# EAGLE schematic vr42-plate (EAGLE 9.6.2)
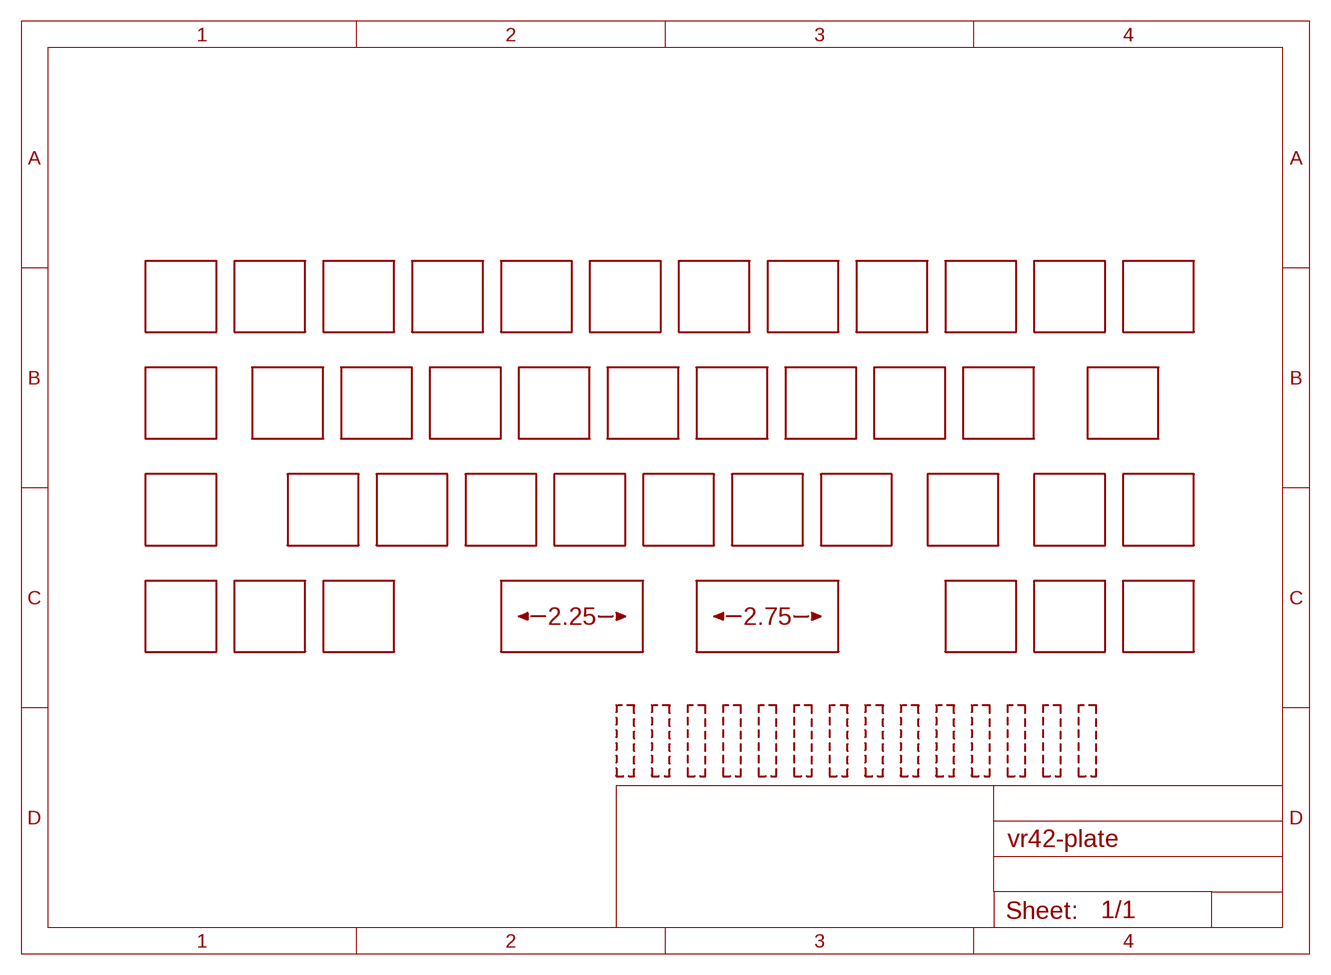
[diagram p0: schematic, sheet 1]

## Parts
U$1  PLATE_1.00U  [CHERRY_MX_CUTOUT_1.00]
U$2  PLATE_1.00U  [CHERRY_MX_CUTOUT_1.00]
U$3  PLATE_1.00U  [CHERRY_MX_CUTOUT_1.00]
U$4  PLATE_1.00U  [CHERRY_MX_CUTOUT_1.00]
U$5  PLATE_1.00U  [CHERRY_MX_CUTOUT_1.00]
U$6  PLATE_1.00U  [CHERRY_MX_CUTOUT_1.00]
U$7  PLATE_1.00U  [CHERRY_MX_CUTOUT_1.00]
U$8  PLATE_1.00U  [CHERRY_MX_CUTOUT_1.00]
U$9  PLATE_1.00U  [CHERRY_MX_CUTOUT_1.00]
U$10  PLATE_1.00U  [CHERRY_MX_CUTOUT_1.00]
U$11  PLATE_1.00U  [CHERRY_MX_CUTOUT_1.00]
U$12  PLATE_1.00U  [CHERRY_MX_CUTOUT_1.00]
U$13  PLATE_1.25U  [CHERRY_MX_CUTOUT_1.25]
U$14  PLATE_1.25U  [CHERRY_MX_CUTOUT_1.25]
U$15  PLATE_1.25U  [CHERRY_MX_CUTOUT_1.25]
U$16  PLATE_1.25U  [CHERRY_MX_CUTOUT_1.25]
U$17  PLATE_1.00U  [CHERRY_MX_CUTOUT_1.00]
U$18  PLATE_1.00U  [CHERRY_MX_CUTOUT_1.00]
U$19  PLATE_1.00U  [CHERRY_MX_CUTOUT_1.00]
U$20  PLATE_1.00U  [CHERRY_MX_CUTOUT_1.00]
U$21  PLATE_1.00U  [CHERRY_MX_CUTOUT_1.00]
U$22  PLATE_1.00U  [CHERRY_MX_CUTOUT_1.00]
U$23  PLATE_1.00U  [CHERRY_MX_CUTOUT_1.00]
U$24  PLATE_1.00U  [CHERRY_MX_CUTOUT_1.00]
U$25  PLATE_1.00U  [CHERRY_MX_CUTOUT_1.00]
U$26  PLATE_1.75U  [CHERRY_MX_CUTOUT_1.75]
U$27  PLATE_1.75U  [CHERRY_MX_CUTOUT_1.75]
U$28  PLATE_1.00U  [CHERRY_MX_CUTOUT_1.00]
U$29  PLATE_1.00U  [CHERRY_MX_CUTOUT_1.00]
U$30  PLATE_1.00U  [CHERRY_MX_CUTOUT_1.00]
U$31  PLATE_1.00U  [CHERRY_MX_CUTOUT_1.00]
U$32  PLATE_1.00U  [CHERRY_MX_CUTOUT_1.00]
U$33  PLATE_1.00U  [CHERRY_MX_CUTOUT_1.00]
U$34  PLATE_1.00U  [CHERRY_MX_CUTOUT_1.00]
U$35  PLATE_1.00U  [CHERRY_MX_CUTOUT_1.00]
U$36  PLATE_1.00U  [CHERRY_MX_CUTOUT_1.00]
U$37  PLATE_1.00U  [CHERRY_MX_CUTOUT_1.00]
U$38  PLATE_1.00U  [CHERRY_MX_CUTOUT_1.00]
U$39  PLATE_1.00U  [CHERRY_MX_CUTOUT_1.00]
U$40  PLATE_1.00U  [CHERRY_MX_CUTOUT_1.00]
U$41  PLATE_2.00U  [CHERRY_MX_CUTOUT_2.00]
U$42  PLATE_2.00U  [CHERRY_MX_CUTOUT_2.00]
U$43  PLATE_D_2.25  [MX_DIMM_2.25]
U$44  PLATE_D_2.75  [MX_DIMM_2.75]
U$45  ACUSTIC_2MM  [ACUSTIC_2.00]
U$46  ACUSTIC_2MM  [ACUSTIC_2.00]
U$47  ACUSTIC_2MM  [ACUSTIC_2.00]
U$48  ACUSTIC_2MM  [ACUSTIC_2.00]
U$49  ACUSTIC_2MM  [ACUSTIC_2.00]
U$50  ACUSTIC_2MM  [ACUSTIC_2.00]
U$51  ACUSTIC_2MM  [ACUSTIC_2.00]
U$52  ACUSTIC_2MM  [ACUSTIC_2.00]
U$53  ACUSTIC_2MM  [ACUSTIC_2.00]
U$54  ACUSTIC_2MM  [ACUSTIC_2.00]
U$55  ACUSTIC_2MM  [ACUSTIC_2.00]
U$56  ACUSTIC_2MM  [ACUSTIC_2.00]
U$57  ACUSTIC_2MM  [ACUSTIC_2.00]
U$58  ACUSTIC_2MM  [ACUSTIC_2.00]

## Library data of the parts
U$1-U$12 U$17-U$25 U$28-U$40 = tecsmith_keeb_plates:PLATE_1.00U
U$13-U$16 = tecsmith_keeb_plates:PLATE_1.25U
U$26 U$27 = tecsmith_keeb_plates:PLATE_1.75U
U$41 U$42 = tecsmith_keeb_plates:PLATE_2.00U
U$43 = tecsmith_keeb_plates:PLATE_D_2.25
U$44 = tecsmith_keeb_plates:PLATE_D_2.75
U$45-U$58 = tecsmith_keeb_plates:ACUSTIC_2MM